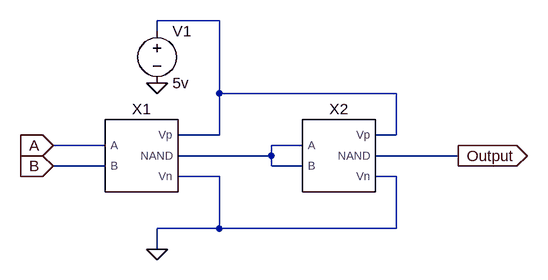
[diagram p0: schematic AND_Gate.asc]
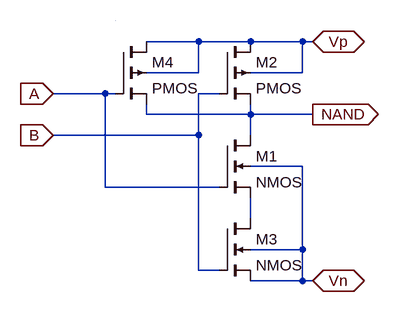
[diagram p1: sub-circuit cmos-nand.asc]
AND_Gate.asc, the LTspice schematic file:
Version 4
SHEET 1 880 680
WIRE 208 -48 112 -48
WIRE 112 -32 112 -48
WIRE 208 64 208 -48
WIRE 480 64 208 64
WIRE 208 128 208 64
WIRE 208 128 144 128
WIRE 480 128 480 64
WIRE 480 128 448 128
WIRE 32 144 -48 144
WIRE 336 144 288 144
WIRE 288 160 288 144
WIRE 288 160 144 160
WIRE 576 160 448 160
WIRE 32 176 -48 176
WIRE 288 176 288 160
WIRE 336 176 288 176
WIRE 208 192 144 192
WIRE 480 192 448 192
WIRE 208 272 208 192
WIRE 208 272 112 272
WIRE 480 272 480 192
WIRE 480 272 208 272
WIRE 112 304 112 272
FLAG 112 48 0
FLAG 112 304 0
FLAG -48 144 A
IOPIN -48 144 In
FLAG -48 176 B
IOPIN -48 176 In
FLAG 576 160 Output
IOPIN 576 160 Out
SYMBOL cmos-nand 80 160 R0
SYMATTR InstName X1
SYMBOL cmos-nand 384 160 R0
SYMATTR InstName X2
SYMBOL voltage 112 -48 R0
WINDOW 123 0 0 Left 0
WINDOW 39 0 0 Left 0
SYMATTR InstName V1
SYMATTR Value 5v

cmos-nand.asc, the sub-circuit schematic file:
Version 4
SHEET 1 880 680
WIRE 128 32 48 32
WIRE 208 32 128 32
WIRE 288 32 208 32
WIRE 304 32 288 32
WIRE 128 80 128 32
WIRE 128 80 48 80
WIRE 288 80 288 32
WIRE 288 80 208 80
WIRE -16 112 -96 112
WIRE 0 112 -16 112
WIRE 160 112 128 112
WIRE 48 144 48 128
WIRE 208 144 208 128
WIRE 208 144 48 144
WIRE 304 144 208 144
WIRE 128 176 128 112
WIRE 128 176 -96 176
WIRE 208 176 208 144
WIRE 288 224 208 224
WIRE -16 256 -16 112
WIRE 160 256 -16 256
WIRE 208 304 208 272
WIRE 288 352 288 224
WIRE 288 352 208 352
WIRE 128 384 128 176
WIRE 160 384 128 384
WIRE 288 400 288 352
WIRE 288 400 208 400
WIRE 304 400 288 400
WIRE 0 0 0 0
FLAG 304 32 Vp
IOPIN 304 32 BiDir
FLAG 304 400 Vn
IOPIN 304 400 BiDir
FLAG 304 144 NAND
IOPIN 304 144 Out
FLAG -96 112 A
IOPIN -96 112 In
FLAG -96 176 B
IOPIN -96 176 In
SYMBOL nmos4 160 176 R0
SYMATTR InstName M1
SYMBOL pmos4 160 32 R0
SYMATTR InstName M2
SYMBOL nmos4 160 304 R0
SYMATTR InstName M3
SYMBOL pmos4 0 32 R0
SYMATTR InstName M4

The netlist it stands for:
* AND_Gate.asc
XX1 A B N002 0 N001 cmos-nand
XX2 N002 N002 Output 0 N001 cmos-nand
V1 N001 0 5v

* block symbol definitions
.subckt cmos-nand A B NAND Vn Vp
M1 NAND A N001 Vn NMOS
M2 Vp B NAND Vp PMOS
M3 N001 B Vn Vn NMOS
M4 Vp A NAND Vp PMOS
.ends cmos-nand

.model NMOS NMOS
.model PMOS PMOS
.lib standard.mos
.backanno
.end